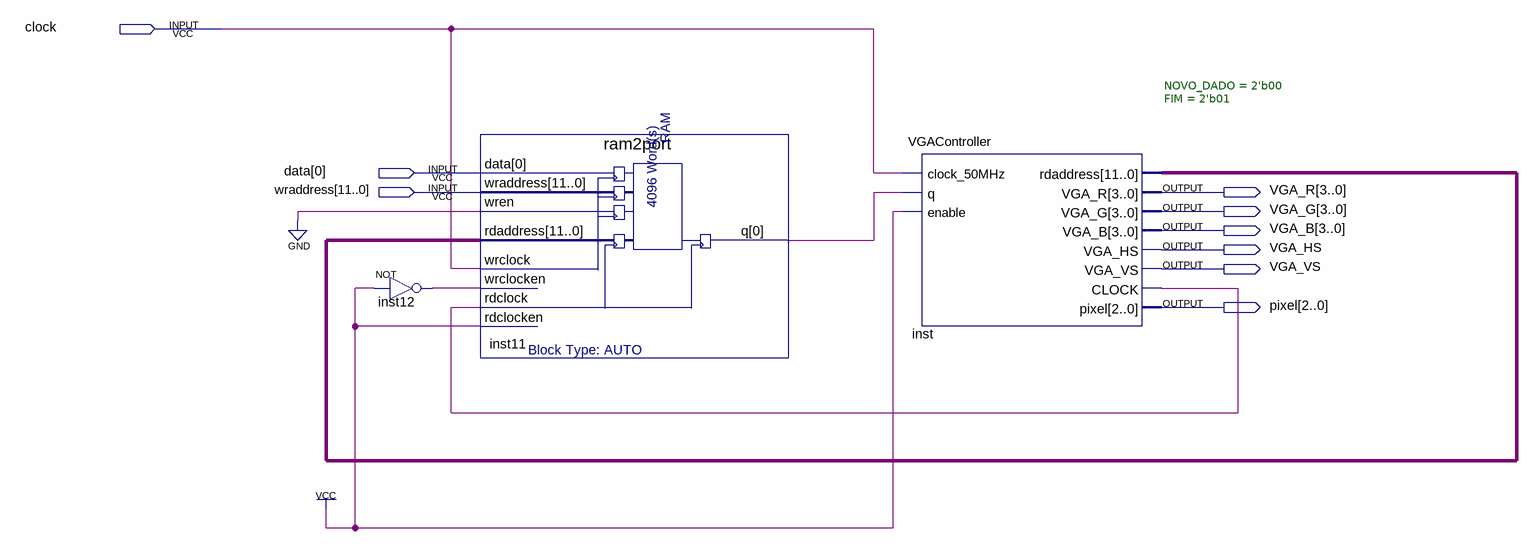
[diagram p0: schematic sheet]
// Quartus schematic PBL3.bdf as structural Verilog: 3 symbols, 9 pins
module PBL3 (
  input  clock,
  input  [0:0] data,
  input  [11:0] wraddress,
  output [3:0] VGA_R,
  output [3:0] VGA_G,
  output [3:0] VGA_B,
  output VGA_HS,
  output VGA_VS,
  output [2:0] pixel
);

  wire inst11_q, inst12_out, inst_clock;
  wire [11:0] inst_rdaddress;

  not inst12 (inst12_out, 1'b1);
  ram2port inst11 (
    .data(data[0]), .wraddress(wraddress), .wren(1'b0), .rdaddress(inst_rdaddress), .wrclock(clock),
    .wrclocken(inst12_out), .rdclock(inst_clock), .rdclocken(1'b1), .q(inst11_q));
  VGAController #(.NOVO_DADO(2'b00), .FIM(2'b01)) inst (
    .clock_50MHz(clock), .q(inst11_q), .enable(1'b1), .rdaddress(inst_rdaddress), .VGA_R(VGA_R),
    .VGA_G(VGA_G), .VGA_B(VGA_B), .VGA_HS(VGA_HS), .VGA_VS(VGA_VS), .CLOCK(inst_clock), .pixel(pixel));
endmodule
